# EAGLE design WiicameraSingleV2 (EAGLE 7.2.0)
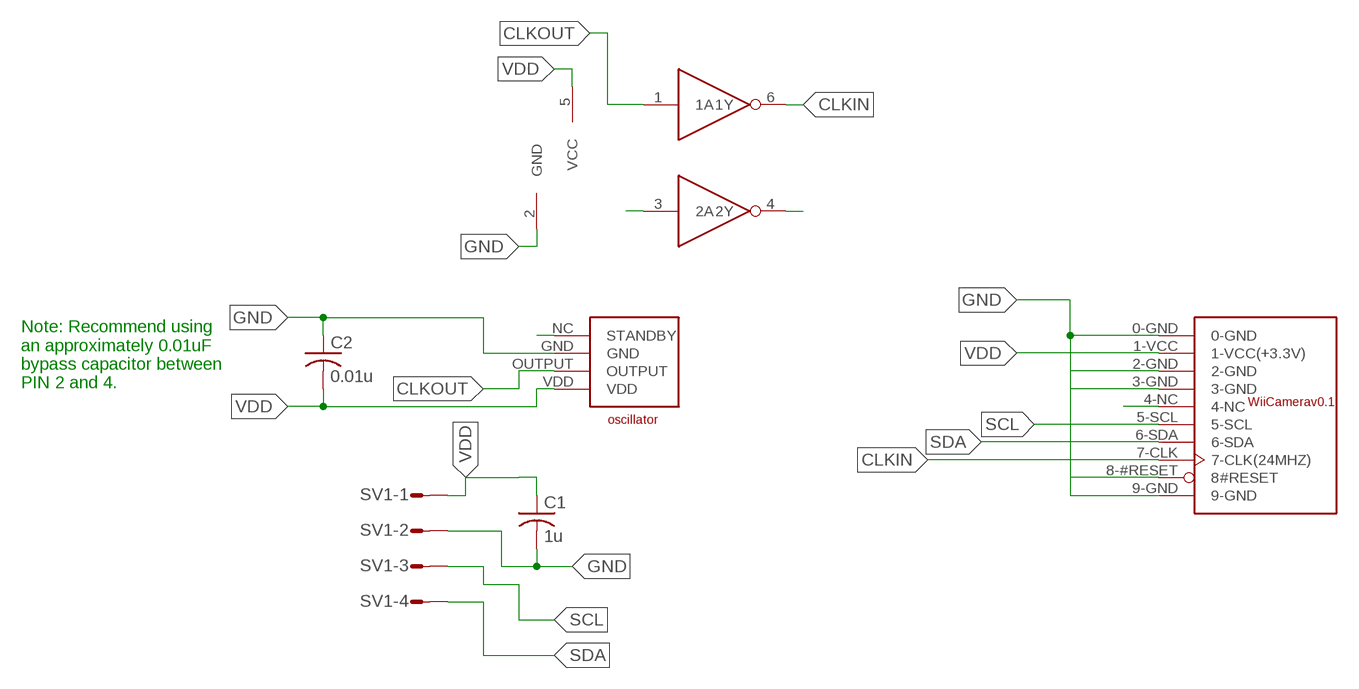
[diagram p0: schematic, sheet 1]

## Parts
C1  1u  C-USC0805  [C0805]
C2  0.01u  C-USC0805  [C0805]
DUALINV1  SN74LVC2G04  [SN74LVC2G04]
OSC1  OSCILLATOR4-SMD  [OSCILLATOR4-SMD]
SV1  S04P  [S04P]
WII1  WIICAMERA  [WIICAMERA]

## Nets
CLKIN: DUALINV1.6(1Y) WII1.7-CLK(7-CLK(24MHZ))
CLKOUT: DUALINV1.1(1A) OSC1.OUTPUT
GND: C1.2 C2.1 DUALINV1.2(GND) OSC1.GND SV1.2 WII1.0-GND WII1.2-GND WII1.3-GND WII1.8-#RESET(8#RESET) WII1.9-GND
N$10: OSC1.NC(STANDBY)
N$15: DUALINV1.3(2A)
N$17: DUALINV1.4(2Y)
N$22: WII1.4-NC
SCL: SV1.3 WII1.5-SCL
SDA: SV1.4 WII1.6-SDA
VDD: C1.1 C2.2 DUALINV1.5(VCC) OSC1.VDD SV1.1 WII1.1-VCC(1-VCC(+3.3V))

## Notes on the sheet
- Note: Recommend using
  an approximately 0.01uF
  bypass capacitor between
  PIN 2 and 4.

## Library data of the parts
C1 C2 = adafruit:C-US: CAPACITOR, American symbol
DUALINV1 = NaugtyBall:SN74LVC2G04
OSC1 = NaugtyBall:OSCILLATOR4-SMD
SV1 = con-amp-mt:S04P: AMP MT CONNECTOR; OC_FARNELL: unknown; OC_NEWARK: unknown
WII1 = NaugtyBall:WIICAMERA

## Board
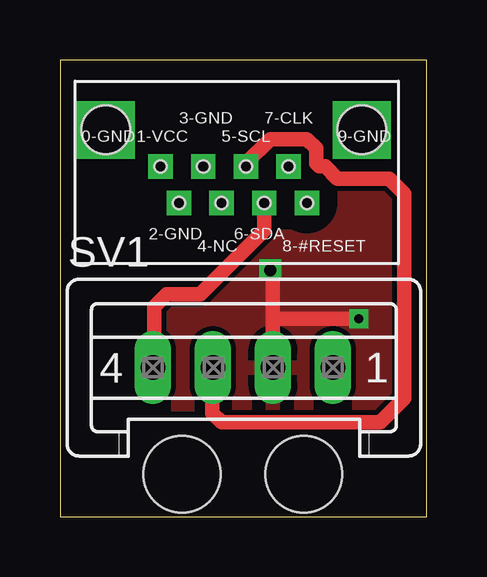
[diagram p1: board, top side]
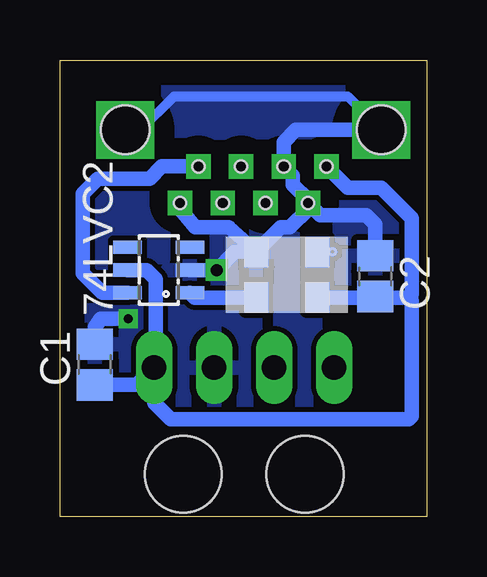
[diagram p2: board, bottom side, seen from below]

Size 15.29 x 19.04 mm. Coordinates in mm from the lower left corner, seen from the top.
Outline: 0,0 15.29,0 15.29,19.04 0,19.04 0,0
Copper layers (1*16): Top 0.035mm / dielectric 1.5mm / Bottom 0.035mm
Design rules "default": minimum track width 10mil, minimum drill 24mil, track to track 8mil, track to pad 8mil, pad to pad 8mil, via to via 8mil, smd to smd 8mil, copper to edge 40mil, drill to drill 8mil, minimum pad ring 10mil, minimum via ring 8mil, stop-mask expansion 4mil, vias tented up to drill 0mil, thermal gap 10mil
Holes 3.2 mm at 5.08,1.78 10.16,1.78

### Footprints (pad centres in the part's own frame; a part is rotated, then mirrored left to right if it is on the bottom)
C0805 = smd 1.3 x 1.5: 1 -0.85,0; 2 0.85,0
SN74LVC2G04 = smd 0.55 x 1.2: 1 -0.95,-1.3; 2 0,-1.3; 3 0.95,-1.3; 4 0.95,1.3; 5 0,1.3; 6 -0.95,1.3
OSCILLATOR4-SMD = smd 1.27 x 1.016: GND 0.635,1.27; NC 0.635,3.81; OUTPUT 2.54,1.27; VDD 2.54,3.81
S04P = drill 1.016 long: 1 3.75,0; 2 1.25,0; 3 -1.25,0; 4 -3.75,0
WIICAMERA = drill 1.6 square: 0-GND 1.27,5.588; 9-GND 11.938,5.588 | drill 0.508 square: 1-VCC 3.556,4.064; 2-GND 4.318,2.54; 3-GND 5.334,4.064; 4-NC 6.096,2.54; 5-SCL 7.112,4.064; 6-SDA 7.874,2.54; 7-CLK 8.89,4.064; 8-#RESET 9.652,2.54 | hole 2.032: 1.27,5.588; 11.938,5.588 | hole 0.508: 3.556,4.064; 5.334,4.064; 7.112,4.064; 8.89,4.064; 4.318,2.54; 6.096,2.54; 7.874,2.54; 9.652,2.54

### Placement (x,y rotation side)
C1  13.84,6.35 90 bottom
C2  2.16,10.03 270 bottom
DUALINV1  11.18,10.29 90 bottom
OSC1  8.38,11.68 270 bottom
SV1  7.62,6.22 0 top
WII1  0.64,10.54 0 top

### Tracks (layer width: path | path; a pad name or v marks a point on that pad's centre or on a via)
CLKIN
  Bottom 0.61: DUALINV1.6 13.53,9.34 14.35,10.16 14.35,13.46 13.72,14.1 11.56,14.1 11.05,14.61 WII1.7-CLK
CLKOUT
  Bottom 0.61: OSC1.OUTPUT 9.68,9.14 DUALINV1.1
GND  (via drill 0.38, 0.5)
  Top 0.61: SV1.2 8.87,8.26 | 8.87,8.26 8.87,10.18 v8.76,10.29 | v12.45,8.26 8.87,8.26
  Bottom 0.406: WII1.9-GND 11.94,16.13 10.54,17.53 3.3,17.53 WII1.0-GND
  Bottom 0.61: C2.1 2.16,12.19 2.54,12.57 4.45,12.57 WII1.2-GND | OSC1.GND 8,11.05 v8.76,10.29 DUALINV1.2 | WII1.8-#RESET 10.29,12.83 9.65,12.06 8.26,12.06 OSC1.GND | C1.2 13.84,7.87 13.59,8.26 v12.45,8.26 | WII1.0-GND 5.46,16.13 5.97,15.62 WII1.3-GND 5.59,14.22 5.59,13.84 4.95,13.21 WII1.2-GND | WII1.2-GND 4.95,12.83 5.71,12.06 6.1,12.06 OSC1.GND
  pour Top: 0,19.05 15.24,19.05 15.24,0 0,0
  pour Bottom: 0,19.05 15.24,19.05 15.24,0 0,0
SCL
  Top 0.61: WII1.5-SCL 7.75,14.73 8.76,15.75 10.29,15.75 10.67,15.37 10.67,14.73 10.79,14.61 11.05,14.61 11.56,14.1 13.72,14.1 14.35,13.46 14.35,4.95 13.34,3.94 6.73,3.94 6.35,4.32 6.35,6.2 SV1.3
SDA
  Top 0.61: WII1.6-SDA 8.51,11.94 5.84,9.27 4.45,9.27 3.94,8.76 3.94,6.29 SV1.4
VDD
  Bottom 0.61: OSC1.VDD 2.2,9.14 C2.2 2.12,9.14 0.76,9.14 | WII1.1-VCC 3.3,13.72 1.91,13.72 0.64,12.45 0.64,9.27 0.76,9.14 | SV1.1 11.37,4.77 10.67,4.06 0.76,4.06 0.64,4.19 0.64,9.02 0.76,9.14 | DUALINV1.5 11.68,10.29 11.3,9.91 11.3,6.29 SV1.1 | C1.1 12.09,5.5 SV1.1